# EAGLE schematic avr-midi-footswitch (EAGLE 8.3.1)
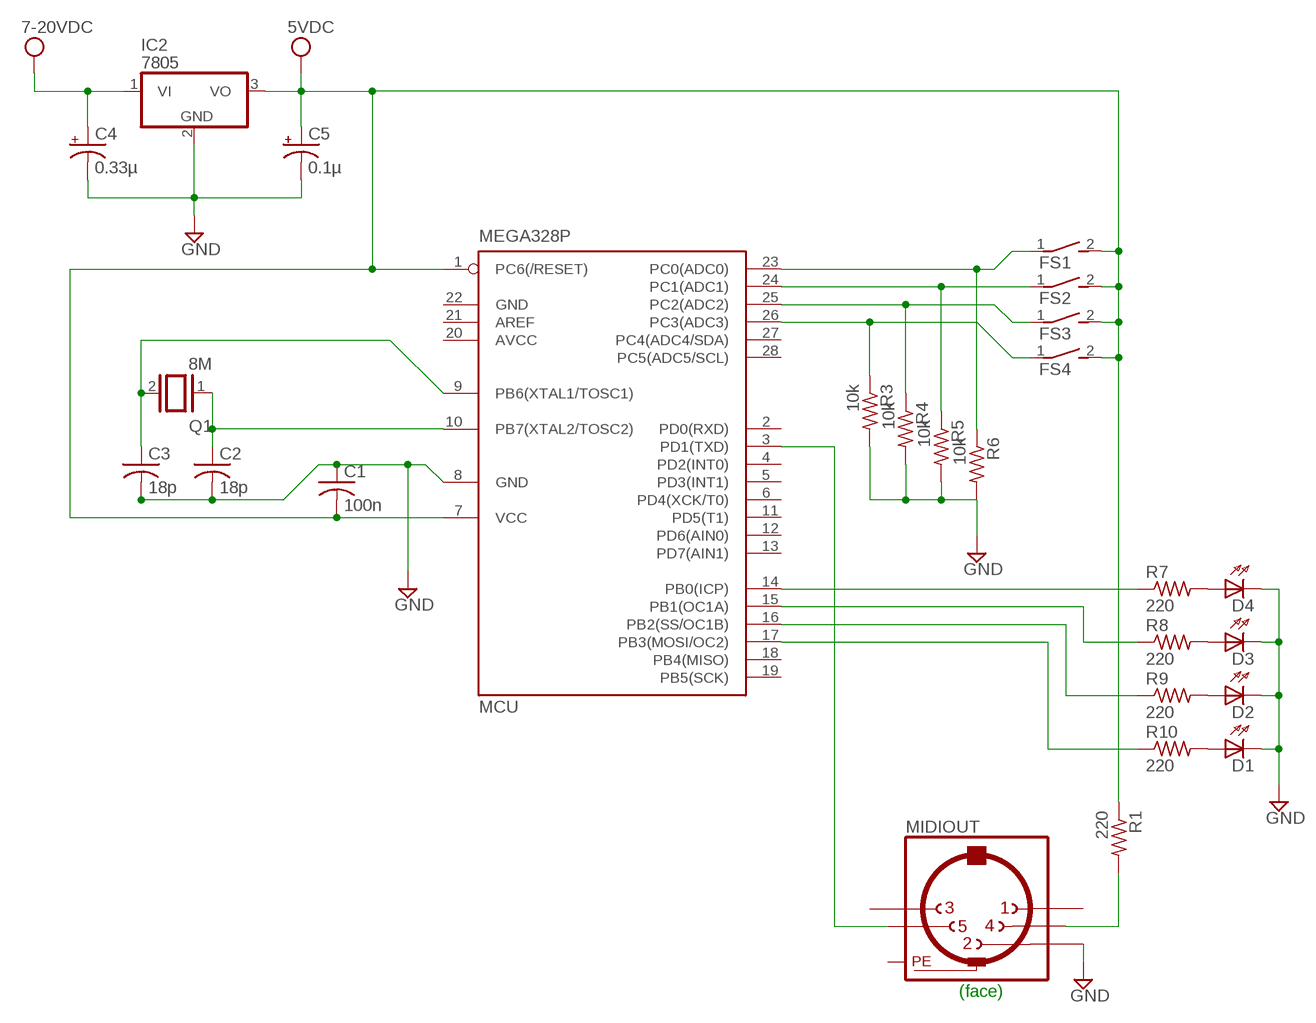
[diagram p0: schematic, sheet 1]

## Parts
C1  100n  C-US025-024X044  [C025-024X044]
C2  18p  C-US025-024X044  [C025-024X044]
C3  18p  C-US025-024X044  [C025-024X044]
C4  0.33µ  CPOL-US085CS-1AR  [085CS_1AR]
C5  0.1µ  CPOL-US085CS-1AR  [085CS_1AR]
D1  HLMP6  [HLMP6]
D2  HLMP6  [HLMP6]
D3  HLMP6  [HLMP6]
D4  HLMP6  [HLMP6]
FS1  DS01E  [DS-01]
FS2  DS01E  [DS-01]
FS3  DS01E  [DS-01]
FS4  DS01E  [DS-01]
IC2  7805  7805T  [TO220H]
MCU  MEGA328P  MEGA8-P  [DIL28-3]
MIDIOUT  MAB5SH  [MAB5SH]
Q1  8M  XTAL  [Q]
R1  220  R-US_0204/2V  [0204V]
R3  10k  R-US_0204/2V  [0204V]
R4  10k  R-US_0204/2V  [0204V]
R5  10k  R-US_0204/2V  [0204V]
R6  10k  R-US_0204/2V  [0204V]
R7  220  R-US_0204/2V  [0204V]
R8  220  R-US_0204/2V  [0204V]
R9  220  R-US_0204/2V  [0204V]
R10  220  R-US_0204/2V  [0204V]

## Nets
GND: C1.1 C2.2 C3.2 C4.- C5.- D1.K D2.K D3.K D4.K IC2.2(GND) MCU.8(GND) MIDIOUT.2 R3.2 R4.2 R5.2 R6.2
N$1: C2.1 MCU.10(PB7(XTAL2/TOSC2)) Q1.1
N$2: MCU.3(PD1(TXD)) MIDIOUT.5
N$3: C3.1 MCU.9(PB6(XTAL1/TOSC1)) Q1.2
N$4: MIDIOUT.4 R1.2
N$5: FS1.1 MCU.23(PC0(ADC0)) R6.1
N$6: FS2.1 MCU.24(PC1(ADC1)) R5.1
N$7: MCU.14(PB0(ICP)) R7.1
N$8: FS3.1 MCU.25(PC2(ADC2)) R4.1
N$9: FS4.1 MCU.26(PC3(ADC3)) R3.1
N$10: MCU.15(PB1(OC1A)) R8.1
N$11: D4.A R7.2
N$12: D3.A R8.2
N$13: D2.A R9.2
N$14: D1.A R10.2
N$15: MCU.16(PB2(SS/OC1B)) R9.1
N$16: MCU.17(PB3(MOSI/OC2)) R10.1
VCC: C1.2 C4.+ C5.+ FS1.2 FS2.2 FS3.2 FS4.2 IC2.1(VI) IC2.3(VO) MCU.1(PC6(/RESET)) MCU.7(VCC) R1.1 ; supply symbol labelled 7-20VDC, 5VDC
Unconnected: MCU.2(PD0(RXD)) MCU.4(PD2(INT0)) MCU.5(PD3(INT1)) MCU.6(PD4(XCK/T0)) MCU.11(PD5(T1)) MCU.12(PD6(AIN0)) MCU.13(PD7(AIN1)) MCU.18(PB4(MISO)) MCU.19(PB5(SCK)) MCU.21(AREF) MCU.27(PC4(ADC4/SDA)) MCU.28(PC5(ADC5/SCL)) MIDIOUT.1 MIDIOUT.3

## Notes on the sheet
- (face)

## Power pins joined to a net without a drawn wire
AVCC: MCU.20(AVCC)
GND: MCU.22(GND)
PE: MIDIOUT.PE MIDIOUT.PE@(PE)

## Library data of the parts
C1-C3 = resistor:C-US: CAPACITOR, American symbol
C4 C5 = resistor:CPOL-US: POLARIZED CAPACITOR, American symbol
D1-D4 = display-hp:HLMP6: LED 2mm horizontal; MF: AGILENT TECHNOLOGIES; MPN: HLMP-6500; OC_FARNELL: 1652490; OC_NEWARK: 40K0088
FS1-FS4 = switch-dil:DS01E: DIL/CODE SWITCH; OC_FARNELL: unknown; OC_NEWARK: unknown
IC2 = linear:78*: Positive VOLTAGE REGULATOR Source: http://cache.national.com/ds/LM/LM78L05.pdf http://www.fairchildsemi.com/ds/LM/LM7805.pdf
MCU = atmel:MEGA8-P: MICROCONTROLLER 8 Kbytes FLASH, 1 kbytes SRAM, 512 bytes EEPROM, USART, 4-channel 10 bit ADC, 2-channel 8 bit ADC Pin compatible with Atmega48, ATMega88, ATMega168 Source: avr.lbr; OC_FARNELL: unknown; OC_NEWARK: unknown
MIDIOUT = con-hirschmann:MAB5SH: Female CONNECTOR 5 pins 90 deg. with shield, horizontal (DIN 41524); OC_FARNELL: 809883; OC_NEWARK: unknown
Q1 = special:XTAL: CRYSTAL
R1 R3-R10 = resistor:R-US_: RESISTOR, American symbol